# Altium schematic sheet 17_FPGA_B12_B13_B14_B15.SchDoc: FPGA Banks 12, 13, 14, 15
size A3; Organization: Lime Microsystems; Address1: Surrey Tech Centre; Address2: Guildford GU2 7YG; Address3: Surrey; Address4: United Kingdom; Revision: v1.0; SheetNumber: 17; SheetTotal: 31
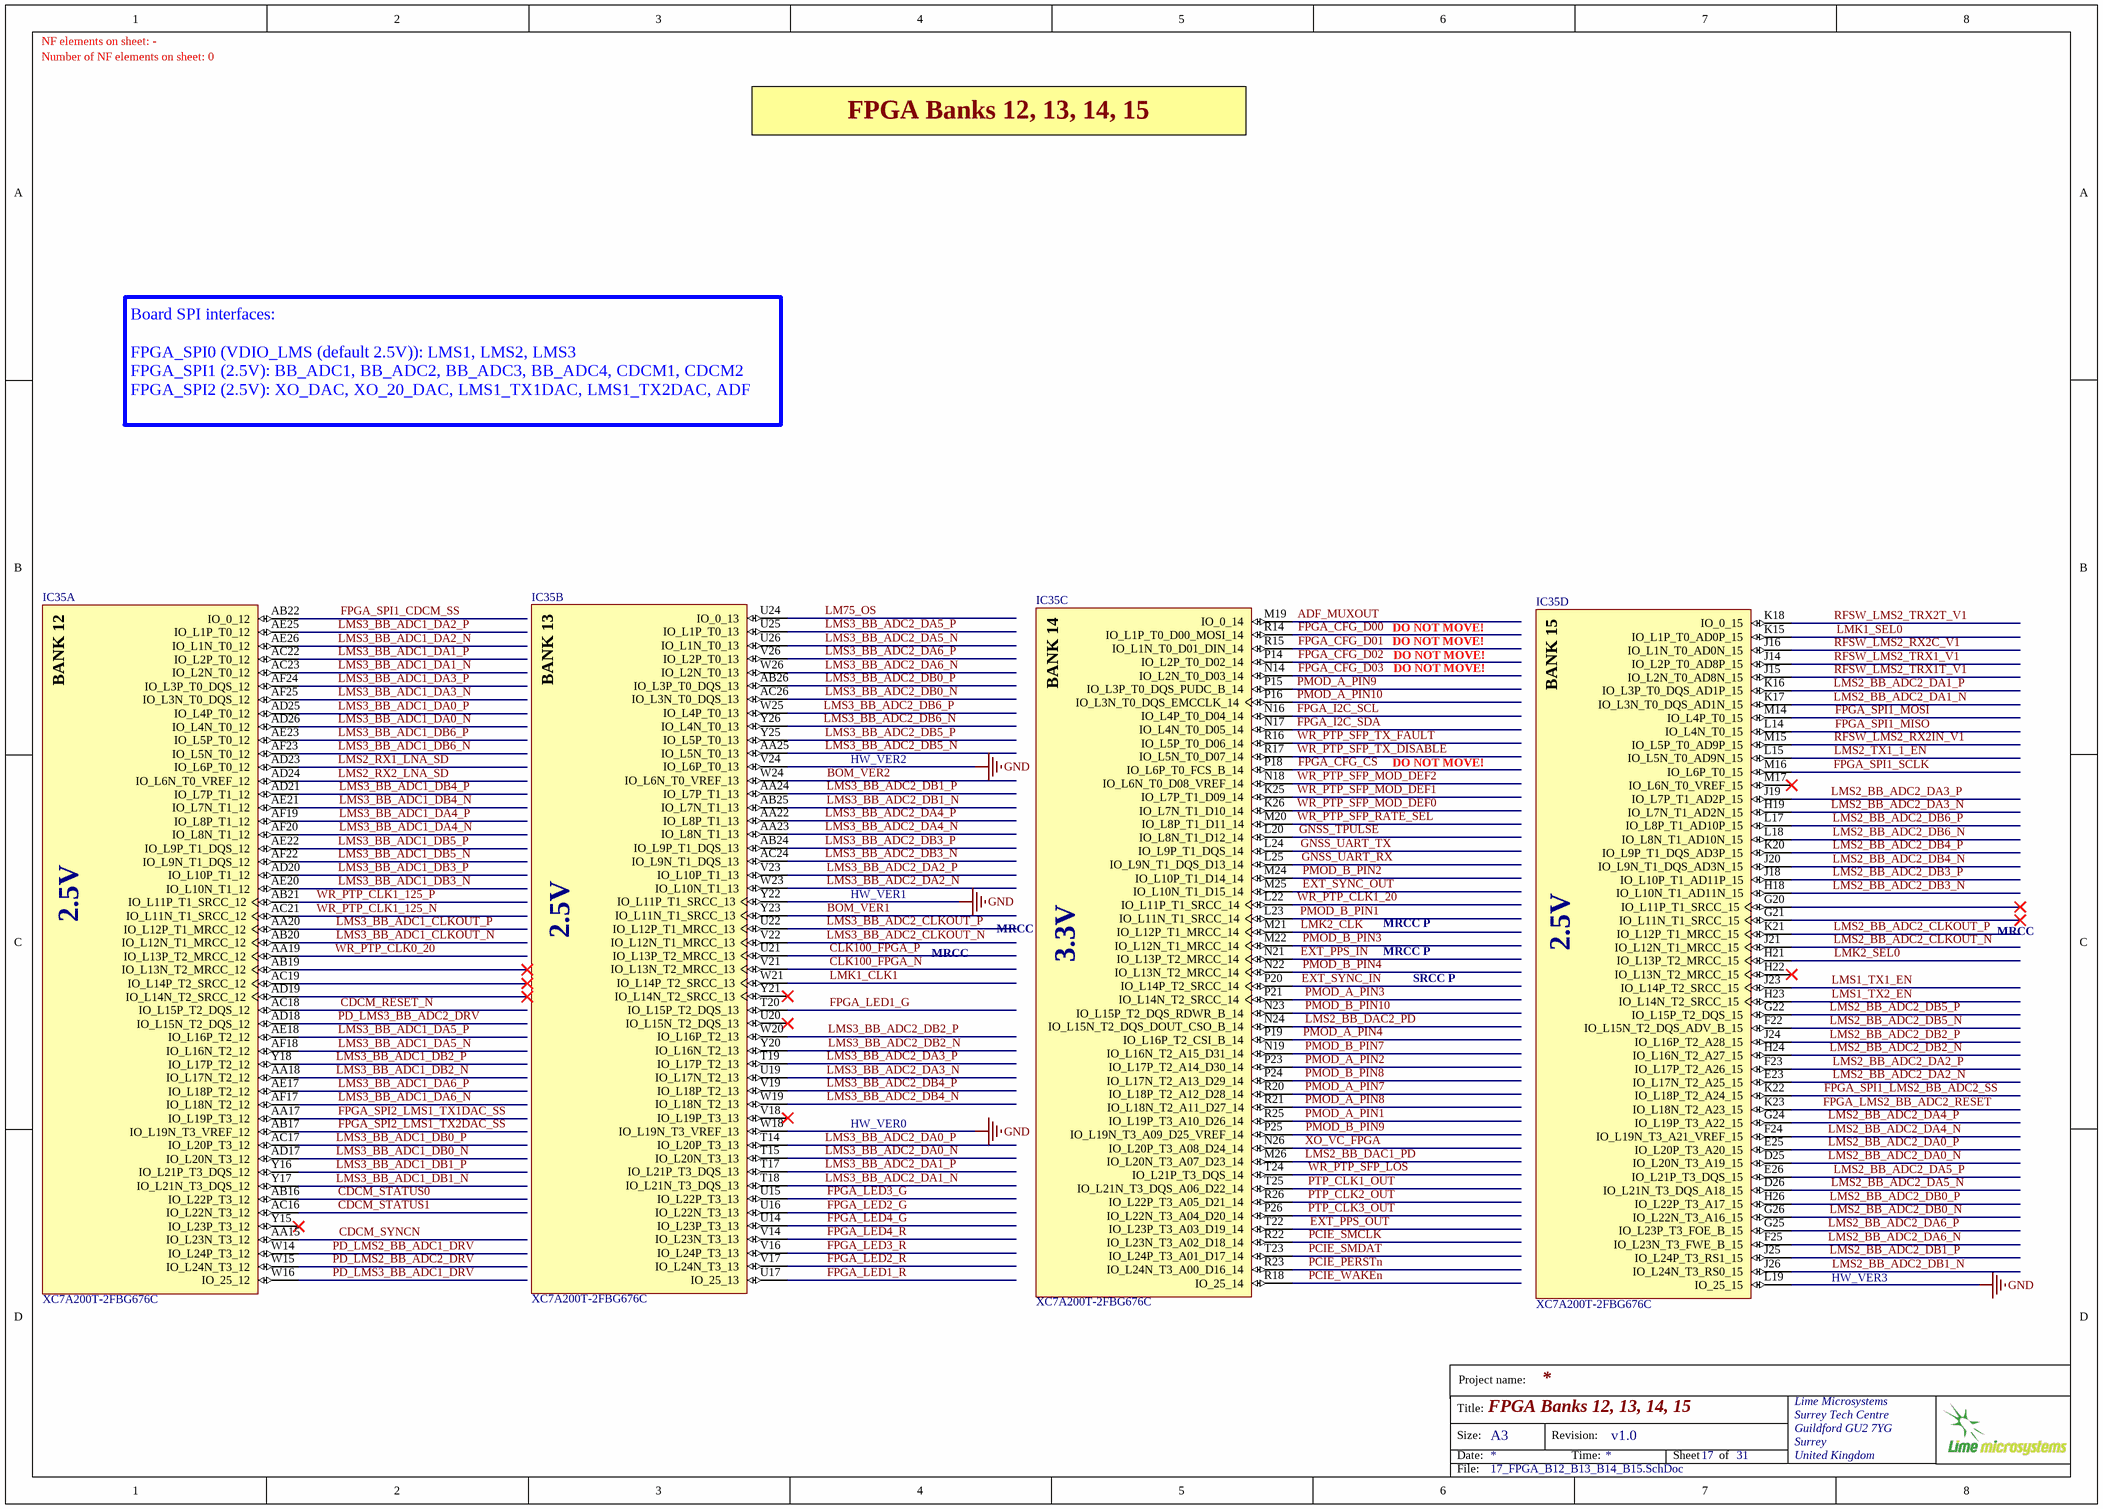
[diagram p0: 17_FPGA_B12_B13_B14_B15.SchDoc]

## Parts
IC35  XC7A200T-2FBG676C  [XC7A200T-2FBG676C_FBG676]  (parts A,B,C,D of 14)

## Nets
GND: IC35.L19(IO_25_15) IC35.V24(IO_L6P_T0_13) IC35.W18(IO_L19N_T3_VREF_13) IC35.Y22(IO_L11P_T1_SRCC_13)
ADF_MUXOUT: IC35.M19(IO_0_14)
BOM_VER1: IC35.Y23(IO_L11N_T1_SRCC_13)
BOM_VER2: IC35.W24(IO_L6N_T0_VREF_13)
CDCM_RESET_N: IC35.AC18(IO_L15P_T2_DQS_12)
CDCM_STATUS0: IC35.AB16(IO_L22P_T3_12)
CDCM_STATUS1: IC35.AC16(IO_L22N_T3_12)
CDCM_SYNCN: IC35.AA15(IO_L23N_T3_12)
CLK100_FPGA_N: IC35.V21(IO_L13N_T2_MRCC_13)
CLK100_FPGA_P: IC35.U21(IO_L13P_T2_MRCC_13)
EXT_PPS_IN: IC35.N21(IO_L13P_T2_MRCC_14)
EXT_PPS_OUT: IC35.T22(IO_L23P_T3_A03_D19_14)
EXT_SYNC_IN: IC35.P20(IO_L14P_T2_SRCC_14)
EXT_SYNC_OUT: IC35.M25(IO_L10N_T1_D15_14)
FPGA_CFG_CS: IC35.P18(IO_L6P_T0_FCS_B_14)
FPGA_CFG_D00: IC35.R14(IO_L1P_T0_D00_MOSI_14)
FPGA_CFG_D01: IC35.R15(IO_L1N_T0_D01_DIN_14)
FPGA_CFG_D02: IC35.P14(IO_L2P_T0_D02_14)
FPGA_CFG_D03: IC35.N14(IO_L2N_T0_D03_14)
FPGA_I2C_SCL: IC35.N16(IO_L4P_T0_D04_14)
FPGA_I2C_SDA: IC35.N17(IO_L4N_T0_D05_14)
FPGA_LED1_G: IC35.T20(IO_L15P_T2_DQS_13)
FPGA_LED1_R: IC35.U17(IO_25_13)
FPGA_LED2_G: IC35.U16(IO_L22N_T3_13)
FPGA_LED2_R: IC35.V17(IO_L24N_T3_13)
FPGA_LED3_G: IC35.U15(IO_L22P_T3_13)
FPGA_LED3_R: IC35.V16(IO_L24P_T3_13)
FPGA_LED4_G: IC35.U14(IO_L23P_T3_13)
FPGA_LED4_R: IC35.V14(IO_L23N_T3_13)
FPGA_LMS2_BB_ADC2_RESET: IC35.K23(IO_L18N_T2_A23_15)
FPGA_SPI1_CDCM_SS: IC35.AB22(IO_0_12)
FPGA_SPI1_LMS2_BB_ADC2_SS: IC35.K22(IO_L18P_T2_A24_15)
FPGA_SPI1_MISO: IC35.L14(IO_L4N_T0_15)
FPGA_SPI1_MOSI: IC35.M14(IO_L4P_T0_15)
FPGA_SPI1_SCLK: IC35.M16(IO_L6P_T0_15)
FPGA_SPI2_LMS1_TX1DAC_SS: IC35.AA17(IO_L19P_T3_12)
FPGA_SPI2_LMS1_TX2DAC_SS: IC35.AB17(IO_L19N_T3_VREF_12)
GNSS_TPULSE: IC35.L20(IO_L8N_T1_D12_14)
GNSS_UART_RX: IC35.L25(IO_L9N_T1_DQS_D13_14)
GNSS_UART_TX: IC35.L24(IO_L9P_T1_DQS_14)
LM75_OS: IC35.U24(IO_0_13)
LMK1_CLK1: IC35.W21(IO_L14P_T2_SRCC_13)
LMK1_SEL0: IC35.K15(IO_L1P_T0_AD0P_15)
LMK2_CLK: IC35.M21(IO_L12P_T1_MRCC_14)
LMK2_SEL0: IC35.H21(IO_L13P_T2_MRCC_15)
LMS1_TX1_EN: IC35.J23(IO_L14P_T2_SRCC_15)
LMS1_TX2_EN: IC35.H23(IO_L14N_T2_SRCC_15)
LMS2_BB_ADC2_CLKOUT_N: IC35.J21(IO_L12N_T1_MRCC_15)
LMS2_BB_ADC2_CLKOUT_P: IC35.K21(IO_L12P_T1_MRCC_15)
LMS2_BB_ADC2_DA0_N: IC35.D25(IO_L20N_T3_A19_15)
LMS2_BB_ADC2_DA0_P: IC35.E25(IO_L20P_T3_A20_15)
LMS2_BB_ADC2_DA1_N: IC35.K17(IO_L3N_T0_DQS_AD1N_15)
LMS2_BB_ADC2_DA1_P: IC35.K16(IO_L3P_T0_DQS_AD1P_15)
LMS2_BB_ADC2_DA2_N: IC35.E23(IO_L17N_T2_A25_15)
LMS2_BB_ADC2_DA2_P: IC35.F23(IO_L17P_T2_A26_15)
LMS2_BB_ADC2_DA3_N: IC35.H19(IO_L7N_T1_AD2N_15)
LMS2_BB_ADC2_DA3_P: IC35.J19(IO_L7P_T1_AD2P_15)
LMS2_BB_ADC2_DA4_N: IC35.F24(IO_L19N_T3_A21_VREF_15)
LMS2_BB_ADC2_DA4_P: IC35.G24(IO_L19P_T3_A22_15)
LMS2_BB_ADC2_DA5_N: IC35.D26(IO_L21N_T3_DQS_A18_15)
LMS2_BB_ADC2_DA5_P: IC35.E26(IO_L21P_T3_DQS_15)
LMS2_BB_ADC2_DA6_N: IC35.F25(IO_L23N_T3_FWE_B_15)
LMS2_BB_ADC2_DA6_P: IC35.G25(IO_L23P_T3_FOE_B_15)
LMS2_BB_ADC2_DB0_N: IC35.G26(IO_L22N_T3_A16_15)
LMS2_BB_ADC2_DB0_P: IC35.H26(IO_L22P_T3_A17_15)
LMS2_BB_ADC2_DB1_N: IC35.J26(IO_L24N_T3_RS0_15)
LMS2_BB_ADC2_DB1_P: IC35.J25(IO_L24P_T3_RS1_15)
LMS2_BB_ADC2_DB2_N: IC35.H24(IO_L16N_T2_A27_15)
LMS2_BB_ADC2_DB2_P: IC35.J24(IO_L16P_T2_A28_15)
LMS2_BB_ADC2_DB3_N: IC35.H18(IO_L10N_T1_AD11N_15)
LMS2_BB_ADC2_DB3_P: IC35.J18(IO_L10P_T1_AD11P_15)
LMS2_BB_ADC2_DB4_N: IC35.J20(IO_L9N_T1_DQS_AD3N_15)
LMS2_BB_ADC2_DB4_P: IC35.K20(IO_L9P_T1_DQS_AD3P_15)
LMS2_BB_ADC2_DB5_N: IC35.F22(IO_L15N_T2_DQS_ADV_B_15)
LMS2_BB_ADC2_DB5_P: IC35.G22(IO_L15P_T2_DQS_15)
LMS2_BB_ADC2_DB6_N: IC35.L18(IO_L8N_T1_AD10N_15)
LMS2_BB_ADC2_DB6_P: IC35.L17(IO_L8P_T1_AD10P_15)
LMS2_BB_DAC1_PD: IC35.M26(IO_L20N_T3_A07_D23_14)
LMS2_BB_DAC2_PD: IC35.N24(IO_L15N_T2_DQS_DOUT_CSO_B_14)
LMS2_RX1_LNA_SD: IC35.AD23(IO_L6P_T0_12)
LMS2_RX2_LNA_SD: IC35.AD24(IO_L6N_T0_VREF_12)
LMS2_TX1_1_EN: IC35.L15(IO_L5N_T0_AD9N_15)
LMS3_BB_ADC1_CLKOUT_N: IC35.AB20(IO_L12N_T1_MRCC_12)
LMS3_BB_ADC1_CLKOUT_P: IC35.AA20(IO_L12P_T1_MRCC_12)
LMS3_BB_ADC1_DA0_N: IC35.AD26(IO_L4N_T0_12)
LMS3_BB_ADC1_DA0_P: IC35.AD25(IO_L4P_T0_12)
LMS3_BB_ADC1_DA1_N: IC35.AC23(IO_L2N_T0_12)
LMS3_BB_ADC1_DA1_P: IC35.AC22(IO_L2P_T0_12)
LMS3_BB_ADC1_DA2_N: IC35.AE26(IO_L1N_T0_12)
LMS3_BB_ADC1_DA2_P: IC35.AE25(IO_L1P_T0_12)
LMS3_BB_ADC1_DA3_N: IC35.AF25(IO_L3N_T0_DQS_12)
LMS3_BB_ADC1_DA3_P: IC35.AF24(IO_L3P_T0_DQS_12)
LMS3_BB_ADC1_DA4_N: IC35.AF20(IO_L8N_T1_12)
LMS3_BB_ADC1_DA4_P: IC35.AF19(IO_L8P_T1_12)
LMS3_BB_ADC1_DA5_N: IC35.AF18(IO_L16N_T2_12)
LMS3_BB_ADC1_DA5_P: IC35.AE18(IO_L16P_T2_12)
LMS3_BB_ADC1_DA6_N: IC35.AF17(IO_L18N_T2_12)
LMS3_BB_ADC1_DA6_P: IC35.AE17(IO_L18P_T2_12)
LMS3_BB_ADC1_DB0_N: IC35.AD17(IO_L20N_T3_12)
LMS3_BB_ADC1_DB0_P: IC35.AC17(IO_L20P_T3_12)
LMS3_BB_ADC1_DB1_N: IC35.Y17(IO_L21N_T3_DQS_12)
LMS3_BB_ADC1_DB1_P: IC35.Y16(IO_L21P_T3_DQS_12)
LMS3_BB_ADC1_DB2_N: IC35.AA18(IO_L17N_T2_12)
LMS3_BB_ADC1_DB2_P: IC35.Y18(IO_L17P_T2_12)
LMS3_BB_ADC1_DB3_N: IC35.AE20(IO_L10N_T1_12)
LMS3_BB_ADC1_DB3_P: IC35.AD20(IO_L10P_T1_12)
LMS3_BB_ADC1_DB4_N: IC35.AE21(IO_L7N_T1_12)
LMS3_BB_ADC1_DB4_P: IC35.AD21(IO_L7P_T1_12)
LMS3_BB_ADC1_DB5_N: IC35.AF22(IO_L9N_T1_DQS_12)
LMS3_BB_ADC1_DB5_P: IC35.AE22(IO_L9P_T1_DQS_12)
LMS3_BB_ADC1_DB6_N: IC35.AF23(IO_L5N_T0_12)
LMS3_BB_ADC1_DB6_P: IC35.AE23(IO_L5P_T0_12)
LMS3_BB_ADC2_CLKOUT_N: IC35.V22(IO_L12N_T1_MRCC_13)
LMS3_BB_ADC2_CLKOUT_P: IC35.U22(IO_L12P_T1_MRCC_13)
LMS3_BB_ADC2_DA0_N: IC35.T15(IO_L20N_T3_13)
LMS3_BB_ADC2_DA0_P: IC35.T14(IO_L20P_T3_13)
LMS3_BB_ADC2_DA1_N: IC35.T18(IO_L21N_T3_DQS_13)
LMS3_BB_ADC2_DA1_P: IC35.T17(IO_L21P_T3_DQS_13)
LMS3_BB_ADC2_DA2_N: IC35.W23(IO_L10N_T1_13)
LMS3_BB_ADC2_DA2_P: IC35.V23(IO_L10P_T1_13)
LMS3_BB_ADC2_DA3_N: IC35.U19(IO_L17N_T2_13)
LMS3_BB_ADC2_DA3_P: IC35.T19(IO_L17P_T2_13)
LMS3_BB_ADC2_DA4_N: IC35.AA23(IO_L8N_T1_13)
LMS3_BB_ADC2_DA4_P: IC35.AA22(IO_L8P_T1_13)
LMS3_BB_ADC2_DA5_N: IC35.U26(IO_L1N_T0_13)
LMS3_BB_ADC2_DA5_P: IC35.U25(IO_L1P_T0_13)
LMS3_BB_ADC2_DA6_N: IC35.W26(IO_L2N_T0_13)
LMS3_BB_ADC2_DA6_P: IC35.V26(IO_L2P_T0_13)
LMS3_BB_ADC2_DB0_N: IC35.AC26(IO_L3N_T0_DQS_13)
LMS3_BB_ADC2_DB0_P: IC35.AB26(IO_L3P_T0_DQS_13)
LMS3_BB_ADC2_DB1_N: IC35.AB25(IO_L7N_T1_13)
LMS3_BB_ADC2_DB1_P: IC35.AA24(IO_L7P_T1_13)
LMS3_BB_ADC2_DB2_N: IC35.Y20(IO_L16N_T2_13)
LMS3_BB_ADC2_DB2_P: IC35.W20(IO_L16P_T2_13)
LMS3_BB_ADC2_DB3_N: IC35.AC24(IO_L9N_T1_DQS_13)
LMS3_BB_ADC2_DB3_P: IC35.AB24(IO_L9P_T1_DQS_13)
LMS3_BB_ADC2_DB4_N: IC35.W19(IO_L18N_T2_13)
LMS3_BB_ADC2_DB4_P: IC35.V19(IO_L18P_T2_13)
LMS3_BB_ADC2_DB5_N: IC35.AA25(IO_L5N_T0_13)
LMS3_BB_ADC2_DB5_P: IC35.Y25(IO_L5P_T0_13)
LMS3_BB_ADC2_DB6_N: IC35.Y26(IO_L4N_T0_13)
LMS3_BB_ADC2_DB6_P: IC35.W25(IO_L4P_T0_13)
PCIE_PERSTn: IC35.R23(IO_L24N_T3_A00_D16_14)
PCIE_SMCLK: IC35.R22(IO_L23N_T3_A02_D18_14)
PCIE_SMDAT: IC35.T23(IO_L24P_T3_A01_D17_14)
PCIE_WAKEn: IC35.R18(IO_25_14)
PD_LMS2_BB_ADC1_DRV: IC35.W14(IO_L24P_T3_12)
PD_LMS2_BB_ADC2_DRV: IC35.W15(IO_L24N_T3_12)
PD_LMS3_BB_ADC1_DRV: IC35.W16(IO_25_12)
PD_LMS3_BB_ADC2_DRV: IC35.AD18(IO_L15N_T2_DQS_12)
PMOD_A_PIN1: IC35.R25(IO_L19P_T3_A10_D26_14)
PMOD_A_PIN2: IC35.P23(IO_L17P_T2_A14_D30_14)
PMOD_A_PIN3: IC35.P21(IO_L14N_T2_SRCC_14)
PMOD_A_PIN4: IC35.P19(IO_L16P_T2_CSI_B_14)
PMOD_A_PIN7: IC35.R20(IO_L18P_T2_A12_D28_14)
PMOD_A_PIN8: IC35.R21(IO_L18N_T2_A11_D27_14)
PMOD_A_PIN9: IC35.P15(IO_L3P_T0_DQS_PUDC_B_14)
PMOD_A_PIN10: IC35.P16(IO_L3N_T0_DQS_EMCCLK_14)
PMOD_B_PIN1: IC35.L23(IO_L11N_T1_SRCC_14)
PMOD_B_PIN2: IC35.M24(IO_L10P_T1_D14_14)
PMOD_B_PIN3: IC35.M22(IO_L12N_T1_MRCC_14)
PMOD_B_PIN4: IC35.N22(IO_L13N_T2_MRCC_14)
PMOD_B_PIN7: IC35.N19(IO_L16N_T2_A15_D31_14)
PMOD_B_PIN8: IC35.P24(IO_L17N_T2_A13_D29_14)
PMOD_B_PIN9: IC35.P25(IO_L19N_T3_A09_D25_VREF_14)
PMOD_B_PIN10: IC35.N23(IO_L15P_T2_DQS_RDWR_B_14)
PTP_CLK1_OUT: IC35.T25(IO_L21N_T3_DQS_A06_D22_14)
PTP_CLK2_OUT: IC35.R26(IO_L22P_T3_A05_D21_14)
PTP_CLK3_OUT: IC35.P26(IO_L22N_T3_A04_D20_14)
RFSW_LMS2_RX2C_V1: IC35.J16(IO_L1N_T0_AD0N_15)
RFSW_LMS2_RX2IN_V1: IC35.M15(IO_L5P_T0_AD9P_15)
RFSW_LMS2_TRX1_V1: IC35.J14(IO_L2P_T0_AD8P_15)
RFSW_LMS2_TRX1T_V1: IC35.J15(IO_L2N_T0_AD8N_15)
RFSW_LMS2_TRX2T_V1: IC35.K18(IO_0_15)
WR_PTP_CLK0_20: IC35.AA19(IO_L13P_T2_MRCC_12)
WR_PTP_CLK1_20: IC35.L22(IO_L11P_T1_SRCC_14)
WR_PTP_CLK1_125_N: IC35.AC21(IO_L11N_T1_SRCC_12)
WR_PTP_CLK1_125_P: IC35.AB21(IO_L11P_T1_SRCC_12)
WR_PTP_SFP_LOS: IC35.T24(IO_L21P_T3_DQS_14)
WR_PTP_SFP_MOD_DEF0: IC35.K26(IO_L7N_T1_D10_14)
WR_PTP_SFP_MOD_DEF1: IC35.K25(IO_L7P_T1_D09_14)
WR_PTP_SFP_MOD_DEF2: IC35.N18(IO_L6N_T0_D08_VREF_14)
WR_PTP_SFP_RATE_SEL: IC35.M20(IO_L8P_T1_D11_14)
WR_PTP_SFP_TX_DISABLE: IC35.R17(IO_L5N_T0_D07_14)
WR_PTP_SFP_TX_FAULT: IC35.R16(IO_L5P_T0_D06_14)
XO_VC_FPGA: IC35.N26(IO_L20P_T3_A08_D24_14)

Not connected (* = marked no-connect by the designer): IC35 AB19(IO_L13N_T2_MRCC_12)* AC19(IO_L14P_T2_SRCC_12)* AD19(IO_L14N_T2_SRCC_12)* G20(IO_L11P_T1_SRCC_15)* G21(IO_L11N_T1_SRCC_15)* H22(IO_L13N_T2_MRCC_15)* M17(IO_L6N_T0_VREF_15)* U20(IO_L15N_T2_DQS_13)* V18(IO_L19P_T3_13)* Y15(IO_L23P_T3_12)* Y21(IO_L14N_T2_SRCC_13)*

## Notes on the sheet
- NF elements on sheet: -
- Number of NF elements on sheet: 0
- FPGA Banks 12, 13, 14, 15
- Board SPI interfaces:
  FPGA_SPI0 (VDIO_LMS (default 2.5V)): LMS1, LMS2, LMS3
  FPGA_SPI1 (2.5V): BB_ADC1, BB_ADC2, BB_ADC3, BB_ADC4, CDCM1, CDCM2
  FPGA_SPI2 (2.5V): XO_DAC, XO_20_DAC, LMS1_TX1DAC, LMS1_TX2DAC, ADF
- DO NOT MOVE!
- HW_VER2
- 2.5V
- HW_VER1
- MRCC
- 3.3V
- MRCC P
- SRCC P
- HW_VER0
- HW_VER3
- Project name:
- Title:
- Size:
- Date:
- A3
- Revision:
- Time:
- Sheet
- of
- File:
- (in symbol XC7A200T-2FBG676C, part A) BANK 12
- (in symbol XC7A200T-2FBG676C, part B) BANK 13
- (in symbol XC7A200T-2FBG676C, part C) BANK 14
- (in symbol XC7A200T-2FBG676C, part D) BANK 15

## Library data of the parts
IC35 = XC7A200T-2FBG676C: Artix-7 FPGA, 400 User I/Os, 8 GTP, 676-Ball BGA, Speed Grade 2, Commercial Grade, Pb-Free; Manufacturer: Xilinx; Part Description: IC FPGA 400 I/O 676FCBGA; Speed Grade: -2; Number of Logic Blocks (LABs): 16825; Number of Logic Elements/Cells: 215360; RAM Size: 13455360b; Number of I/Os: 400; Number of Registers: 269200; Memory Type: DDR3; Memory Size: 1GB; Max Supply Voltage: 1.05V; Min Supply Voltage: 950mV; ComponentLink1Description: Manufacturer URL; ComponentLink1URL: http://www.xilinx.com/; ComponentLink2Description: Datasheet; ComponentLink2URL: http://www.xilinx.com/support/documentation/data_sheets/ds180_7Series_Overview.pdf; ComponentLink3Description: Package Specification; ComponentLink3URL: http://www.xilinx.com/support/documentation/user_guides/ug475_7Series_Pkg_Pinout.pdf; ComponentLink4Description: DC and Switching Characteristics; ComponentLink4URL: http://www.xilinx.com/support/documentation/data_sheets/ds181_Artix_7_Data_Sheet.pdf; ComponentLink5Description: Package File; ComponentLink5URL: http://www.xilinx.com/support/packagefiles/a7packages/xc7a200tfbg676pkg.txt; ComponentLink6Description: Packaging and Pinout; ComponentLink6URL: http://www.xilinx.com/support/documentation/user_guides/ug475_7Series_Pkg_Pinout.pdf; Supplier 1: Digi-Key; Supplier Part Number 1: 122-1865-ND; Manufacturer Part Number 1: XC7A200T-2FBG676C; Stock 1: 124; Pricing 1: 1=261,30000 (USD); RoHS: Yes; Case/Package: FCBGA; Number of Pins: 676; Contact Plating: Copper,Tin,Silver; Min Operating Temperature: 0°C; Max Operating Temperature: 85°C; ComponentLink7URL: https://datasheet.ciiva.com/15066/ds181-artix-7-data-sheet-15066344.pdf?src-supplier=Digi-Key; ComponentLink7Description: https://datasheet.ciiva.com/15066/ds181-artix-7-data-sheet-15066344.pdf?src-supplier=Digi-Key; ComponentLink8URL: https://datasheet.ciiva.com/48475/ds180-7series-overview-48475947.pdf?src-supplier=Avnet; ComponentLink8Description: https://datasheet.ciiva.com/48475/ds180-7series-overview-48475947.pdf?src-supplier=Avnet